# Altium schematic sheet RF_old.SchDoc: RF
size A4; Date: 03/12/2015; Author: Samuel López; Project: H2H Main Board
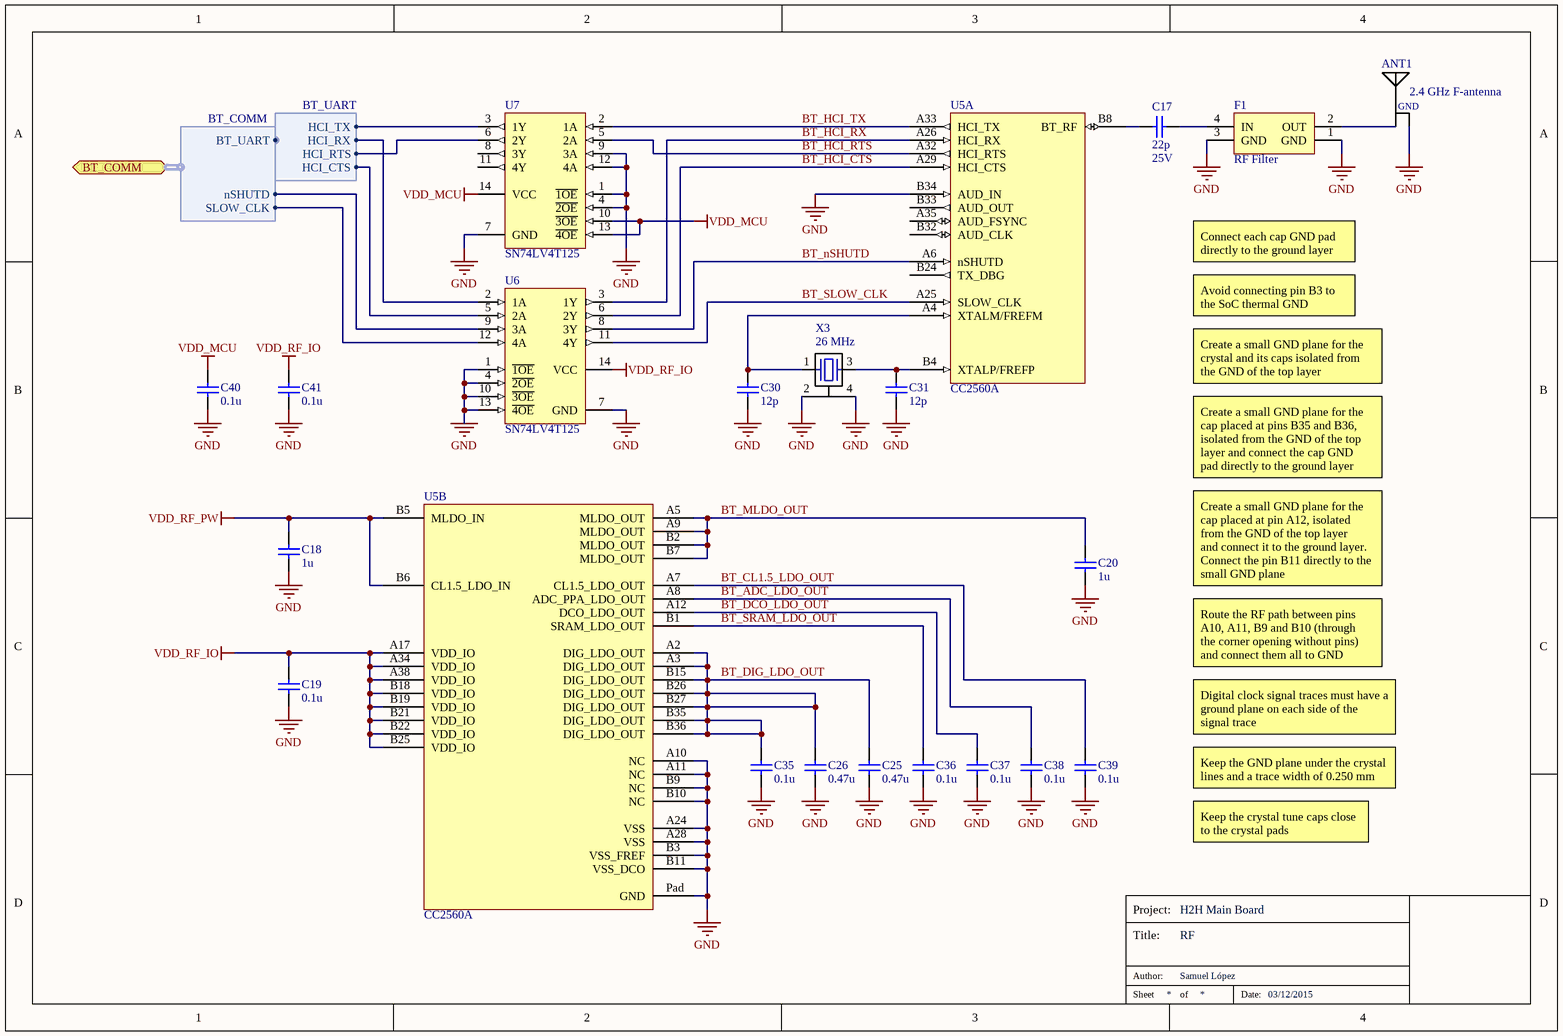
[diagram p0: RF_old.SchDoc]

## Parts
ANT1  2.4 GHz F-antenna  [Antenna]  (net tie, no BOM)
C17  22p  Rated Voltage: 25V  [C0603]
C18  1u  [C0603]
C19  0.1u  [C0603]
C20  1u  [C0603]
C25  0.47u  [C0603]
C26  0.47u  [C0603]
C30  12p  [C0603]
C31  12p  [C0603]
C35  0.1u  [C0603]
C36  0.1u  [C0603]
C37  0.1u  [C0603]
C38  0.1u  [C0603]
C39  0.1u  [C0603]
C40  0.1u  [C0603]
C41  0.1u  [C0603]
F1  RF Filter  [LFB212G45SG8A127]
U5  CC2560A  [CC2560]  (parts A,B of 2)
U6  SN74LV4T125  [PQFN-14]
U7  SN74LV4T125  [PQFN-14]
X3  Frequency: 26 MHz  [NX2016SA]  (hidden comment: NX2016SA)

## Ports
BT_COMM (harness BT_COMM)

## Harnesses
BT_UART: HCI_TX, HCI_RX, HCI_RTS, HCI_CTS
BT_COMM: BT_UART, nSHUTD, SLOW_CLK

## Nets
GND: ANT1.2(GND) C18.1 C19.1 C20.1 C25.1 C26.1 C30.2 C31.2 C35.1 C36.1 C37.1 C38.1 C39.1 C40.1 C41.1 F1.1(GND) F1.3(GND) U5.A10(NC) U5.A11(NC) U5.A24(VSS) U5.A28(VSS) U5.B3(VSS_FREF) U5.B9(NC) U5.B10(NC) U5.B11(VSS_DCO) U5.B34(AUD_IN) U5.Pad(GND) U6.1(~{1OE}) U6.4(~{2OE}) U6.7(GND) U6.10(~{3OE}) U6.13(~{4OE}) U7.1(~{1OE}) U7.4(~{2OE}) U7.7(GND) U7.9(3A) U7.12(4A) X3.2 X3.4
VDD_MCU: C40.2 U7.10(~{3OE}) U7.13(~{4OE}) U7.14(VCC)
VDD_RF_IO: C19.2 C41.2 U5.A17(VDD_IO) U5.A34(VDD_IO) U5.A38(VDD_IO) U5.B18(VDD_IO) U5.B19(VDD_IO) U5.B21(VDD_IO) U5.B22(VDD_IO) U5.B25(VDD_IO) U6.14(VCC)
VDD_RF_PW: C18.2 U5.B5(MLDO_IN) U5.B6(CL1.5_LDO_IN)
BT_ADC_LDO_OUT: C38.2 U5.A8(ADC_PPA_LDO_OUT)
BT_CL1.5_LDO_OUT: C39.2 U5.A7(CL1.5_LDO_OUT)
BT_DCO_LDO_OUT: C37.2 U5.A12(DCO_LDO_OUT)
BT_DIG_LDO_OUT: C25.2 C26.2 C35.2 U5.A2(DIG_LDO_OUT) U5.A3(DIG_LDO_OUT) U5.B15(DIG_LDO_OUT) U5.B26(DIG_LDO_OUT) U5.B27(DIG_LDO_OUT) U5.B35(DIG_LDO_OUT) U5.B36(DIG_LDO_OUT)
BT_HCI_CTS: U5.A29(HCI_CTS) U6.6(2Y)
BT_HCI_RTS: U5.A32(HCI_RTS) U7.5(2A)
BT_HCI_RX: U5.A26(HCI_RX) U6.3(1Y)
BT_HCI_TX: U5.A33(HCI_TX) U7.2(1A)
BT_MLDO_OUT: C20.2 U5.A5(MLDO_OUT) U5.A9(MLDO_OUT) U5.B2(MLDO_OUT) U5.B7(MLDO_OUT)
BT_nSHUTD: U5.A6(nSHUTD) U6.8(3Y)
BT_SLOW_CLK: U5.A25(SLOW_CLK) U6.11(4Y)
BT_SRAM_LDO_OUT: C36.2 U5.B1(SRAM_LDO_OUT)
NetANT1_1: ANT1.1(IN) F1.2(OUT)
NetC17_1: C17.1 F1.4(IN)
NetC17_2: C17.2 U5.B8(BT_RF)
NetC30_1: C30.1 U5.A4(XTALM/FREFM) X3.1
NetC31_1: C31.1 U5.B4(XTALP/FREFP) X3.3
NetU6_2: U6.2(1A) ; harness BT_UART.HCI_RX
NetU6_5: U6.5(2A) ; harness BT_UART.HCI_CTS
NetU6_9: U6.9(3A) ; port BT_COMM.nSHUTD
NetU6_12: U6.12(4A) ; port BT_COMM.SLOW_CLK
NetU7_3: U7.3(1Y) ; harness BT_UART.HCI_TX
NetU7_6: U7.6(2Y) ; harness BT_UART.HCI_RTS

Not connected (* = marked no-connect by the designer): U5 A35(AUD_FSYNC) B24(TX_DBG) B32(AUD_CLK) B33(AUD_OUT); U7 8(3Y) 11(4Y)

## Notes on the sheet
- Connect each cap GND pad
  directly to the ground layer
- Avoid connecting pin B3 to
  the SoC thermal GND
- Create a small GND plane for the
  crystal and its caps isolated from
  the GND of the top layer
- Create a small GND plane for the
  cap placed at pins B35 and B36,
  isolated from the GND of the top
  layer and connect the cap GND
  pad directly to the ground layer
- Create a small GND plane for the
  cap placed at pin A12, isolated
  from the GND of the top layer
  and connect it to the ground layer.
  Connect the pin B11 directly to the
  small GND plane
- Route the RF path between pins
  A10, A11, B9 and B10 (through
  the corner opening without pins)
  and connect them all to GND
- Digital clock signal traces must have a
  ground plane on each side of the
  signal trace
- Keep the GND plane under the crystal
  lines and a trace width of 0.250 mm
- Keep the crystal tune caps close
  to the crystal pads
- Project:
- Title:
- Sheet
- Author:
- of
- Date:

## Library data of the parts
ANT1 = Antenna
C17-C20 C25 C26 C30 C31 C35-C41 = Capacitor
  C17: Value: 22p
  C18 C20: Value: 1u; Rated Voltage: *
  C19 C35-C41: Value: 0.1u; Rated Voltage: *
  C25 C26: Value: 0.47u; Rated Voltage: *
  C30 C31: Value: 12p; Rated Voltage: *
F1 = LFB212G45SG8A127: RF Filter 2.4 GHz; Supplier 1: Digi-Key; Supplier Part Number 1: 490-5021-1-ND
U5 = CC2560A: Bluetooth - BT 4.0 controller (BR/EDR); Supplier 1: Farnell; Supplier Part Number 1: 2334559
U6 U7 = SN74LV4T125: Level Translator; Supplier 1: Digi-Key; Supplier Part Number 1: 296-40546-1-ND
X3 = NX2016SA: Crystal - 26 MHz; Supplier 1: Digi-Key; Supplier Part Number 1: 644-1220-1-ND